# Altium schematic sheet LEDSandButtons.SchDoc
size A; DocumentNumber: 8; SheetNumber: 8; SheetTotal: 8
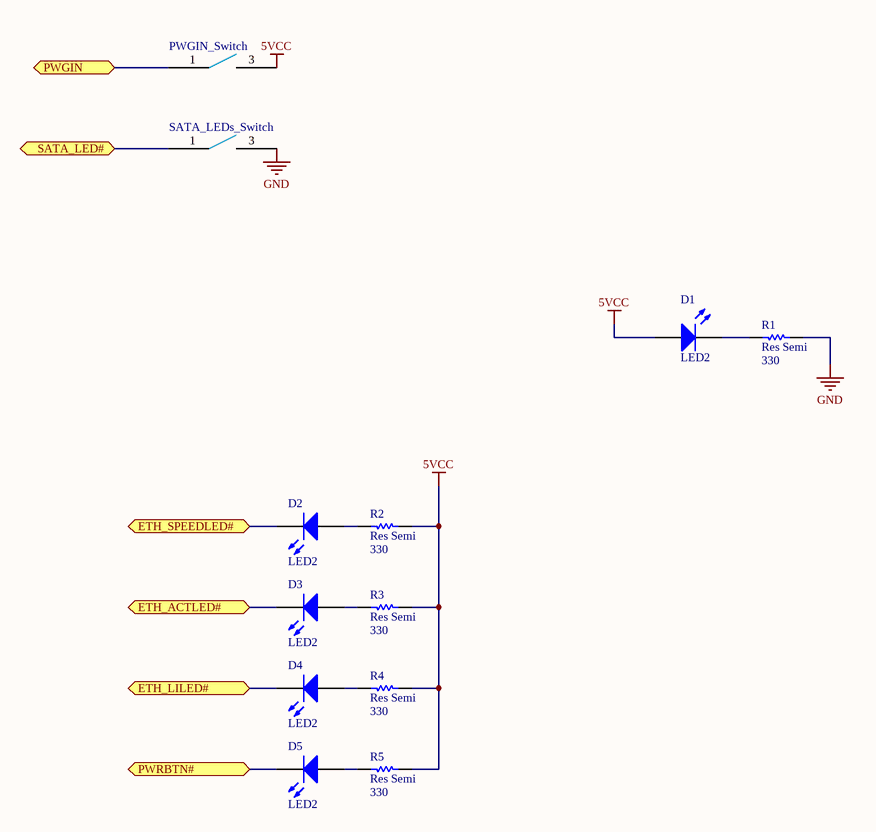
[diagram p0: LEDSandButtons.SchDoc]

## Parts
D1  LED2  [C0805]
D2  LED2  [C0805]
D3  LED2  [C0805]
D4  LED2  [C0805]
D5  LED2  [C0805]
PWGIN_Switch  Switch  [GS02MCBE]  (value not drawn)
R1  Res Semi  value 330  [1005[0402]]
R2  Res Semi  value 330  [1005[0402]]
R3  Res Semi  value 330  [1005[0402]]
R4  Res Semi  value 330  [1005[0402]]
R5  Res Semi  value 330  [1005[0402]]
SATA_LEDs_Switch  Switch  [GS02MCBE]  (value not drawn)

## Ports
ETH_ACTLED#, ETH_LILED#, ETH_SPEEDLED#, PWGIN, PWRBTN#, SATA_LED#

## Nets
5VCC: D1.1(A) PWGIN_Switch.3 R2.1 R3.1 R4.1 R5.1
GND: R1.1 SATA_LEDs_Switch.3
ETH_ACTLED#: D3.2(K) ; port ETH_ACTLED#
ETH_LILED#: D4.2(K) ; port ETH_LILED#
ETH_SPEEDLED#: D2.2(K) ; port ETH_SPEEDLED#
PWGIN: PWGIN_Switch.1 ; port PWGIN
PWRBTN#: D5.2(K) ; port PWRBTN#
SATA_LED#: SATA_LEDs_Switch.1 ; port SATA_LED#
NetD1_2: D1.2(K) R1.2
NetD2_1: D2.1(A) R2.2
NetD3_1: D3.1(A) R3.2
NetD4_1: D4.1(A) R4.2
NetD5_1: D5.1(A) R5.2

## Library data of the parts
D1-D5 = LED2: Typical RED, GREEN, YELLOW, AMBER GaAs LED; Published: 8-Jun-2000; LatestRevisionDate: 17-Jul-2002; LatestRevisionNote: Re-released for DXP Platform.; PackageDocument: Feb-2002; PackageReference: 3.2X1.6X1.1; Publisher: Altium Limited; Supplier Part Number: 160-1423-1-ND; Supplier: Digi-Key
R1-R5 = Res Semi: Semiconductor Resistor; Published: 8-Jun-2000; LatestRevisionDate: 17-Jul-2002; LatestRevisionNote: Re-released for DXP Platform.; PackageReference: AXIAL-0.5; Publisher: Altium Limited; Supplier Part Number: P330JCT-ND; Supplier: Digi-Key
PWGIN_Switch SATA_LEDs_Switch = Switch: Supplier Part Number: GS02MCBE; Supplier: Digi-Key